# Altium project as5311-module.PrjPcb
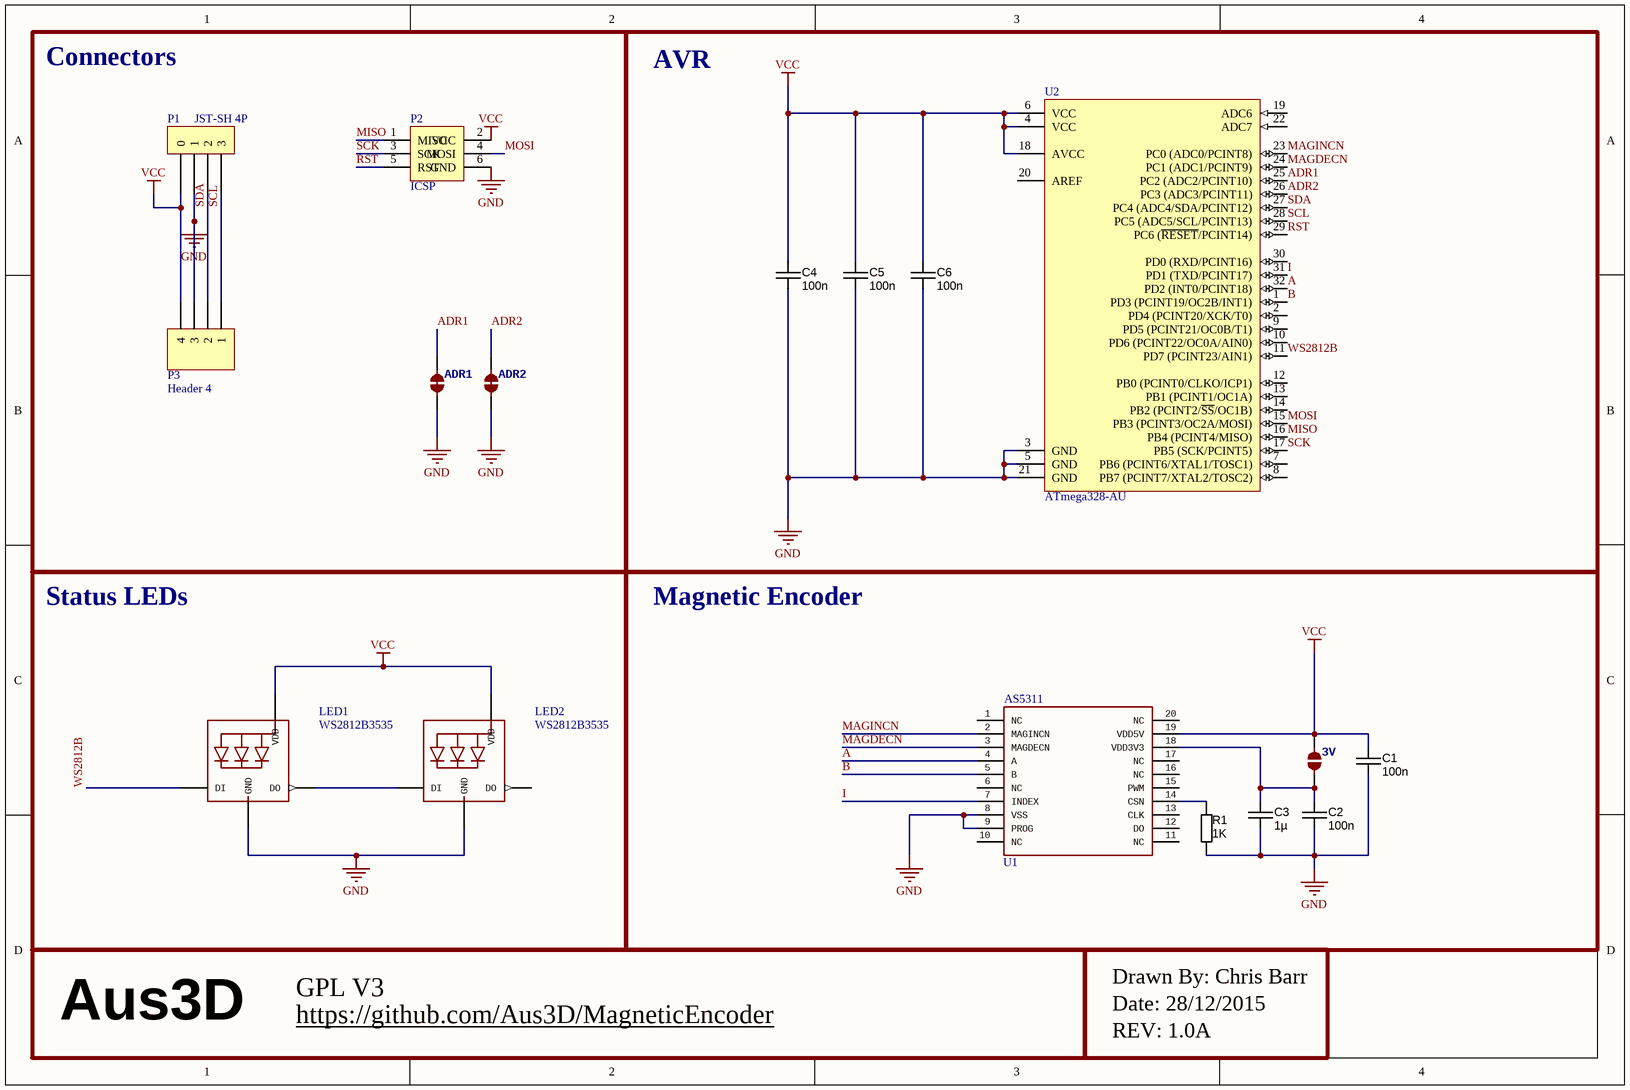
[diagram p0: as5311-module.SchDoc]
1 sheet, 17 parts. Net scope: global (net labels, ports and power ports of the same name join across sheets).
Board file: as5311-module.PcbDoc

## Sheet as5311-module.SchDoc
size 304 x 203 mm

### Parts
3V  JUMPER-PAD-2-NO  [PAD-JUMPER-2-NO_NO_SILK]  (value not drawn)
ADR1  JUMPER-PAD-2-NC_BY_TRACE  [PAD-JUMPER-2-NC_BY_TRACE_YES_SILK]  (value not drawn)
ADR2  JUMPER-PAD-2-NC_BY_TRACE  [PAD-JUMPER-2-NC_BY_TRACE_YES_SILK]  (value not drawn)
C1  value 100n  [CAPC1608X90N]  (hidden comment: approved sub OK)
C2  value 100n  [CAPC1608X90N]  (hidden comment: approved sub OK)
C3  value 1µ  [CAPC1608X90N]  (hidden comment: approved sub OK)
C4  value 100n  [CAPC1608X90N]  (hidden comment: approved sub OK)
C5  value 100n  [CAPC1608X90N]  (hidden comment: approved sub OK)
C6  value 100n  [CAPC1608X90N]  (hidden comment: approved sub OK)
LED1  WS2812B3535  [LED3535]
LED2  WS2812B3535  [LED3535]
P1  JST-SH 4P  [SM04B-SRSS-TB]
P2  ICSP  [ICSP Pads - SMD]
P3  Header 4  [HDR1X4]
R1  value 1K  [RESC1608X55N]  (hidden comment: Thick Film)
U1  AS5311  [TSSOP-20]
U2  ATmega328-AU  [32A_N]

### Blocks framed on the sheet
Connectors: ADR1 ADR2 P1-P3
AVR: C4-C6 U2
Status LEDs: LED1 LED2
Magnetic Encoder: 3V C1-C3 R1 U1

### Nets
GND: ADR1.1 ADR2.1 C1.2 C2.2 C3.2 C4.2 C5.2 C6.2 LED1.4(GND) LED2.4(GND) P1.1 P2.6(GND) P3.3 R1.2 U1.8(VSS) U1.9(PROG) U2.3(GND) U2.5(GND) U2.21(GND)
VCC: 3V.2 C1.1 C4.1 C5.1 C6.1 LED1.2(VDD) LED2.2(VDD) P1.0 P2.2(VCC) P3.4 U1.19(VDD5V) U2.4(VCC) U2.6(VCC) U2.18(AVCC)
A: U1.4(A) U2.32(PD2_(INT0/PCINT18))
ADR1: ADR1.2 U2.25(PC2_(ADC2/PCINT10))
ADR2: ADR2.2 U2.26(PC3_(ADC3/PCINT11))
B: U1.5(B) U2.1(PD3_(PCINT19/OC2B/INT1))
I: U1.7(INDEX) U2.31(PD1_(TXD/PCINT17))
MAGDECN: U1.3(MAGDECN) U2.24(PC1_(ADC1/PCINT9))
MAGINCN: U1.2(MAGINCN) U2.23(PC0_(ADC0/PCINT8))
MISO: P2.1(MISO) U2.16(PB4_(PCINT4/MISO))
MOSI: P2.4(MOSI) U2.15(PB3_(PCINT3/OC2A/MOSI))
RST: P2.5(RST) U2.29(PC6_(~{RESET}/PCINT14))
SCK: P2.3(SCK) U2.17(PB5_(SCK/PCINT5))
SCL: P1.3 P3.1 U2.28(PC5_(ADC5/SCL/PCINT13))
SDA: P1.2 P3.2 U2.27(PC4_(ADC4/SDA/PCINT12))
WS2812B: LED1.1(DI) U2.11(PD7_(PCINT23/AIN1))
Net3V_1: 3V.1 C2.1 C3.1 U1.18(VDD3V3)
NetLED1_3: LED1.3(DO) LED2.1(DI)
NetR1_1: R1.1 U1.14(CSN)

Not connected (* = marked no-connect by the designer): LED2 3(DO); U1 1(NC) 6(NC) 10(NC) 11(NC) 12(DO) 13(CLK) 15(PWM) 16(NC) 17(NC) 20(NC); U2 2(PD4_(PCINT20/XCK/T0)) 7(PB6_(PCINT6/XTAL1/TOSC1)) 8(PB7_(PCINT7/XTAL2/TOSC2)) 9(PD5_(PCINT21/OC0B/T1)) 10(PD6_(PCINT22/OC0A/AIN0)) 12(PB0_(PCINT0/CLKO/ICP1)) 13(PB1_(PCINT1/OC1A)) 14(PB2_(PCINT2/~{SS}/OC1B)) 19(ADC6) 20(AREF) 22(ADC7) 30(PD0_(RXD/PCINT16))

### Notes on the sheet
- Aus3D
- https://github.com/Aus3D/MagneticEncoder
- GPL V3
- Drawn By: Chris Barr
- Date: 28/12/2015
- REV: 1.0A

### Library data of the parts
C1 C2 C4-C6 = CAPC_100n_0603_X7R_50V_10%: Capacitor SMD Cer 100nF 10% 50V X7R 0603; Manufacturer 1: AVX Corporation; Manufacturer Part Number 1: 06035C104KAT2A; Ratings: 50V; X7R; Material: ceramic; SCDType: spec; Manufacturer 2: TDK Corporation; Manufacturer Part Number 2: C1608X7R1H104K; Package / Case: 0603 (1608 Metric); Tolerance: ±10%; Supplier 1: Digi-Key; Supplier Part Number 1: 478-5052-1-ND; ComponentLink1URL: http://www.avx.com/docs/Catalogs/cx7r.pdf; ComponentLink1Description: http://www.avx.com/docs/Catalogs/cx7r.pdf; Supplier 2: Digi-Key; Supplier Part Number 2: 445-1314-1-ND; ComponentLink2URL: http://product.tdk.com/capacitor/mlcc/en/documents/mlcc_commercial_general_en.pdf; ComponentLink2Description: http://product.tdk.com/capacitor/mlcc/en/documents/mlcc_commercial_general_en.pdf
C3 = CAPC_1u_0603_X7R_16V_10%: Capacitor SMD Cer 1uF 10% 16V X7R 0603; Manufacturer 1: TDK Corporation; Manufacturer Part Number 1: C1608X7R1C105K; Ratings: 16V; X7R; Material: ceramic; SCDType: spec; Package / Case: 0603 (1608 metric); Tolerance: ±10%; Supplier 1: Digi-Key; Supplier Part Number 1: 445-1604-1-ND; ComponentLink1URL: http://product.tdk.com/capacitor/mlcc/en/documents/mlcc_commercial_general_en.pdf; ComponentLink1Description: http://product.tdk.com/capacitor/mlcc/en/documents/mlcc_commercial_general_en.pdf
LED1 LED2 = WS2812B3535: Manufacturer 1: DONGGUANG OPSCO OPTOELECTRONICS CO., LTD; Manufacturer Part Number 1: SK6812MINI
P1 = SM04B-SRSS-TB: Supplier 1: Digi-Key; Supplier Part Number 1: 455-1804-1-ND
P2 = Header 3X2: Header, 3-Pin, Dual row; LatestRevisionDate: 17-Jul-2002; LatestRevisionNote: Re-released for DXP Platform.; Publisher: Altium Limited
P3 = Header 4: Header, 4-Pin; LatestRevisionDate: 17-Jul-2002; LatestRevisionNote: Re-released for DXP Platform.; Publisher: Altium Limited
R1 = RES_1K_0603_5%: Resistor SMD chip 1k Ohm 0.1W 5% 0603; Manufacturer 1: Yageo; Manufacturer Part Number 1: RC0603JR-071KL; Ratings: 1/10 W; SCDType: spec; Package / Case: 0603 (1608 metric); Tolerance: ±5%; Material: Thick Film; Supplier 1: Digi-Key; Supplier Part Number 1: 311-1.0KGRCT-ND; Supplier 2: Digi-Key; Supplier Part Number 2: 541-1.0KGCT-ND; Manufacturer 2: Vishay Dale; Manufacturer Part Number 2: CRCW06031K00JNEA; ComponentLink2URL: http://www.vishay.com/doc?20008; ComponentLink2Description: http://www.vishay.com/doc?20008; ComponentLink1URL: http://www.yageo.com/documents/recent/PYu-RC0603_51_RoHS_L_4.pdf; ComponentLink1Description: http://www.yageo.com/documents/recent/PYu-RC0603_51_RoHS_L_4.pdf
U1 = AS5311: AMS's AS5311 linear hall-effect encoder.
U2 = ATmega328-AU: 8-bit AVR Microcontroller, 32KB Flash, 1KB EEPROM, 2KB SRAM, 32-pin TQFP, Industrial Grade (-40°C to 85°C); DatasheetVersion: revD, May-2011; PackageVersion: revC, Oct-2010; PackageReference: 32A; PackageDescription: 32-Lead, 7x7x1.0 mm Body, 0.8mm Lead Pitch, Thin Profile Plastic Quad Flat Package (TQFP); Code_JEDEC: MS-026-ABA; ComponentLink1Description: Manufacturer URL; ComponentLink1URL: http://www.atmel.com/; ComponentLink2Description: ATmega48A/48PA/88A/88PA/168A/168PA/328/328P Datasheet; ComponentLink2URL: http://www.atmel.com/dyn/resources/prod_documents/doc8271.pdf; ComponentLink3Description: ATmega48A/48PA/88A/88PA/168A/168PA/328/328P Summary; ComponentLink3URL: http://www.atmel.com/dyn/resources/prod_documents/8271S.pdf